# EAGLE design ArduinoISP (EAGLE 5.09)
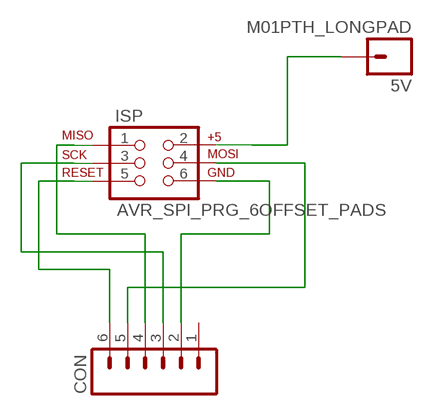
[diagram p0: schematic, sheet 1]

## Parts
5V  M01PTH_LONGPAD  [1X01_LONGPAD]
CON  M06LONGPADS  [1X06_LONGPADS]
ISP  AVR_SPI_PRG_6OFFSET_PADS  [2X3_OFFSET]

## Nets
GND: CON.2 ISP.6
MISO: CON.4 ISP.1
MOSI: CON.5 ISP.4
RESET: CON.6 ISP.5
SCK: CON.3 ISP.3
VCC: 5V.1 ISP.2
Unconnected: CON.1

## Library data of the parts
5V = SparkFun:M01: Header 1 Standard 1-pin 0.1" header. Use with straight break away headers (SKU : PRT-00116), right angle break away headers (PRT-00553), swiss pins (PRT-00743), machine pins (PRT-00117), and female headers (PRT-00115).
CON = SparkFun:M06: Header 6 Standard 6-pin 0.1" header. Use with straight break away headers (SKU : PRT-00116), right angle break away headers (PRT-00553), swiss pins (PRT-00743), machine pins (PRT-00117), and female headers (PRT-00115). Molex polarized connector foot print use with SKU : PRT-08094 with associated crimp pins and housings. NOTES ON THE VARIANTS LOCK and LOCK_LONGPADS... This footprint was designed to help hold the alignment of a through-hole component (i.e. 6-pin header) while soldering it into place. You may notice that each hole has been shifted either up or down by 0.005 of an inch from it's more standard position (which is a perfectly straight line). This slight alteration caused the pins (the squares in the middle) to touch the edges of the holes. Because they are alternating, it causes a "brace" to hold the component in place. 0.005 has proven to be the perfect amount of "off-center" position when using our standard breakaway headers. Although looks a little odd when you look at the bare footprint, once you have a header in there, the alteration is very hard to notice. Also, if you push a header all the way into place, it is covered up entirely on the bottom side. This idea of altering the position of holes to aid alignment will be further integrated into the Sparkfun Library for other footprints. It can help hold any component with 3 or more connection pins.
ISP = SparkFun:AVR_SPI_PRG_6: AVR ISP 6 Pin This is the reduced ISP connector for AVR programming. Common on Arduino. This footprint will take up less PCB space and can be used with a 10-pin to 6-pin adapter such as SKU: BOB-08508

## Board
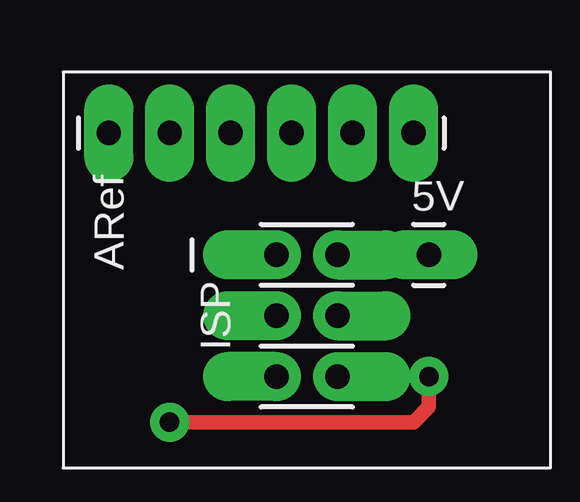
[diagram p1: board, top side]
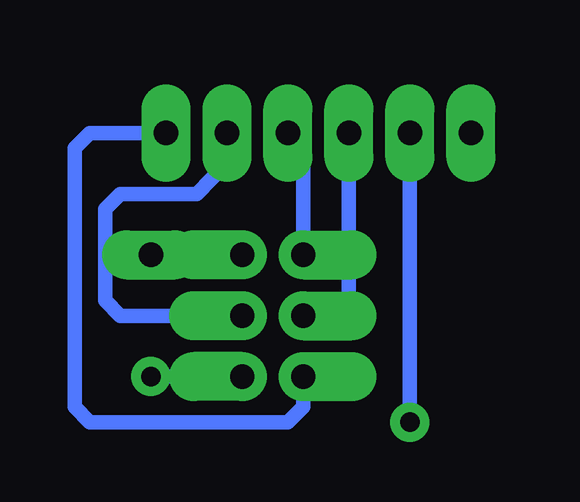
[diagram p2: board, bottom side, seen from below]

No outline drawn. Coordinates in mm, seen from the top.
Copper layers (1*16): Top 0.035mm / dielectric 1.5mm / Bottom 0.035mm
Design rules "standard_home": minimum track width 10mil, minimum drill 0.8mm, track to track 10mil, track to pad 10mil, pad to pad 10mil, via to via 10mil, smd to smd 8mil, copper to edge 10mil, drill to drill 8mil, minimum pad ring 18mil, minimum via ring 10mil, stop-mask expansion 4mil, vias tented up to drill 0mil, thermal gap 10mil

### Footprints (pad centres in the part's own frame; a part is rotated, then mirrored left to right if it is on the bottom)
1X01_LONGPAD = drill 1.016 pad 1.88 long: 1 0,0
1X06_LONGPADS = drill 1.016 pad 1.88 long: 1 0,0; 2 2.54,0; 3 5.08,0; 4 7.62,0; 5 10.16,0; 6 12.7,0
2X3_OFFSET = drill 1.016 pad 1.88 offset: 1 -2.54,-1.27; 2 -2.54,1.27; 3 0,-1.27; 4 0,1.27; 5 2.54,-1.27; 6 2.54,1.27

### Placement (x,y rotation side)
5V  15.24,8.89 90 top
CON  1.91,13.97 0 top
ISP  10.16,6.35 270 top

### Tracks (layer width: path | path; a pad name or v marks a point on that pad's centre or on a via)
GND  (via drill 0.81 pad 1.42)
  Top 0.61: v15.24,3.81 15.24,2.54 14.61,1.91 v4.45,1.91
  Bottom 0.61: ISP.6 v15.24,3.81 | v4.45,1.91 4.45,3.81 4.45,5.08 4.45,5.71 4.45,11.43 4.45,12.06 4.45,12.7 4.45,13.34 CON.2
MISO
  Bottom 0.61: ISP.1 8.89,13.34 CON.4
MOSI
  Bottom 0.61: ISP.4 16.51,6.35 17.14,6.99 17.14,10.79 16.51,11.43 13.34,11.43 12.7,12.06 12.06,12.7 CON.5
RESET
  Bottom 0.61: ISP.5 8.89,2.54 9.53,1.91 17.78,1.91 18.41,2.54 18.41,13.34 17.78,13.97 CON.6
SCK
  Bottom 0.61: ISP.3 7.62,6.35 6.99,6.99 6.99,11.43 6.99,12.06 CON.3
VCC
  Bottom 0.61: ISP.2 5V.1

### Text on the board
tPlace: ARef